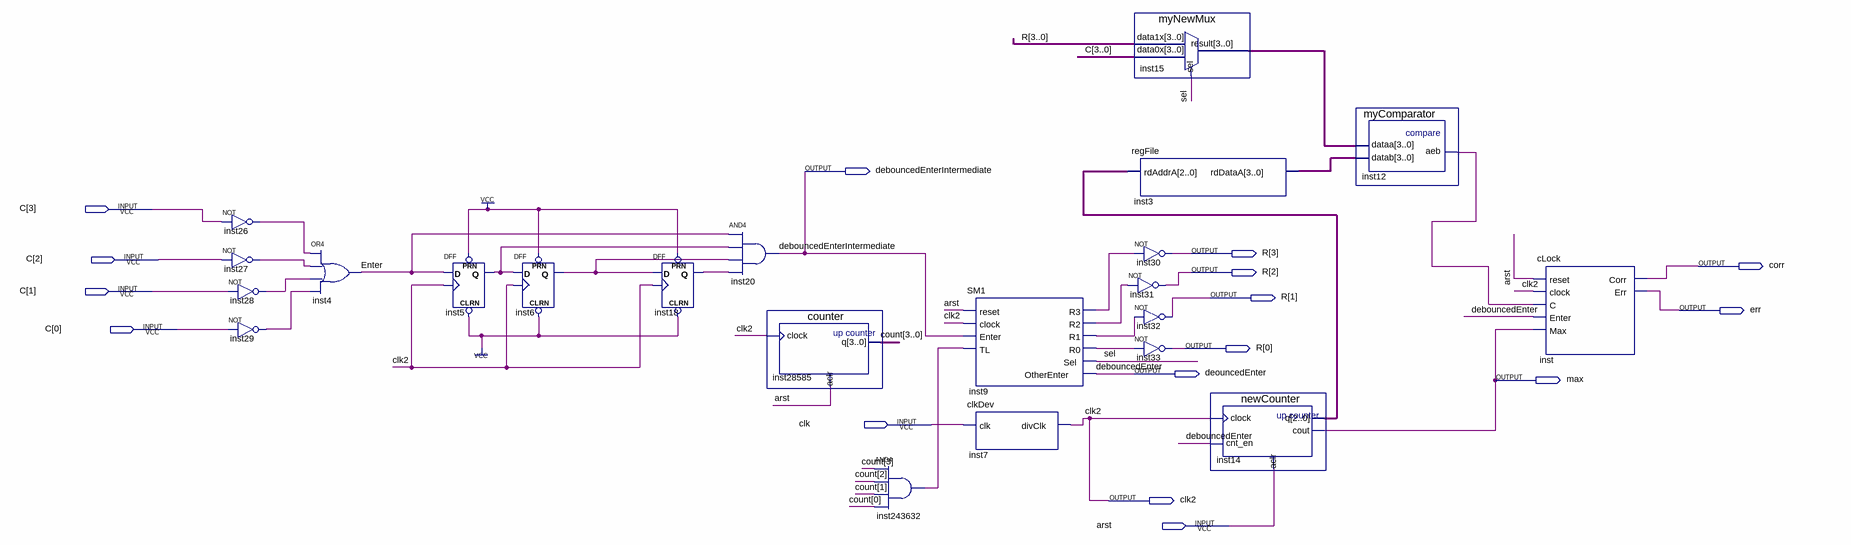
[diagram p0: schematic sheet]
// Quartus schematic Block2.bdf as structural Verilog: 22 symbols, 16 pins
module Block2 (
  input  [3:0] C,
  input  clk,
  input  arst,
  output debouncedEnterIntermediate,
  output [3:0] R,
  output corr,
  output err,
  output deouncedEnter,
  output max,
  output clk2
);

  wire Enter, inst5_q, inst6_q, inst9_r0, inst9_r1, inst9_r2, inst9_r3, inst12_aeb, inst18_q, inst26_out,
       inst27_out, inst28_out, inst29_out, inst243632_out, sel;
  wire [2:0] inst14_q;
  wire [3:0] count, inst3_rddataa, inst15_result;

  not inst26 (inst26_out, C[3]);
  not inst27 (inst27_out, C[2]);
  not inst28 (inst28_out, C[1]);
  not inst29 (inst29_out, C[0]);
  or inst4 (Enter, inst26_out, inst27_out, inst28_out, inst29_out);
  DFF inst5 (.CLRN(1'b1), .CLK(clk2), .D(Enter), .PRN(1'b1), .Q(inst5_q));
  DFF inst6 (.CLRN(1'b1), .CLK(clk2), .D(inst5_q), .PRN(1'b1), .Q(inst6_q));
  DFF inst18 (.CLRN(1'b1), .CLK(clk2), .D(inst6_q), .PRN(1'b1), .Q(inst18_q));
  and inst20 (debouncedEnterIntermediate, Enter, inst5_q, inst6_q, inst18_q);
  counter inst28585 (.clock(clk2), .aclr(arst), .q(count));
  and inst243632 (inst243632_out, count[3], count[2], count[1], count[0]);
  SM1 inst9 (
    .reset(arst), .clock(clk2), .Enter(debouncedEnterIntermediate), .TL(inst243632_out), .R3(inst9_r3),
    .R2(inst9_r2), .R1(inst9_r1), .R0(inst9_r0), .Sel(sel), .OtherEnter(deouncedEnter));
  clkDev inst7 (.clk(clk), .divClk(clk2));
  myNewMux inst15 (.data1x(R), .data0x(C), .sel(sel), .result(inst15_result));
  regFile inst3 (.rdAddrA(inst14_q), .rdDataA(inst3_rddataa));
  not inst30 (R[3], inst9_r3);
  not inst31 (R[2], inst9_r2);
  not inst32 (R[1], inst9_r1);
  not inst33 (R[0], inst9_r0);
  newCounter inst14 (.clock(clk2), .cnt_en(deouncedEnter), .aclr(arst), .cout(max), .q(inst14_q));
  myComparator inst12 (.dataa(inst15_result), .datab(inst3_rddataa), .aeb(inst12_aeb));
  cLock inst (.reset(arst), .clock(clk2), .C(inst12_aeb), .Enter(deouncedEnter), .Max(max), .Corr(corr), .Err(err));

  // Other names for the same wires on the sheet: debouncedEnter = deouncedEnter
endmodule
